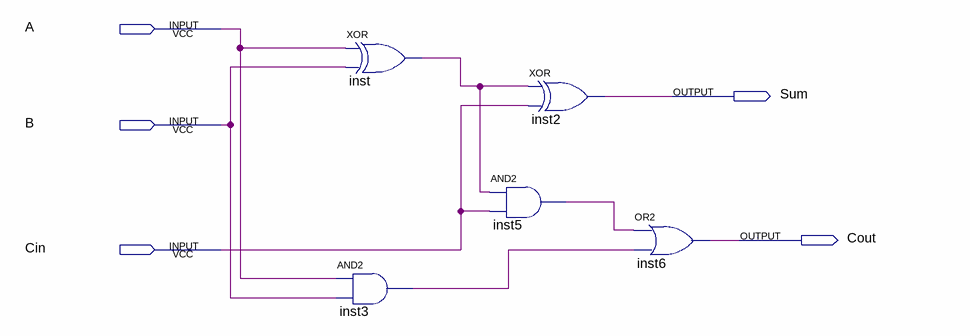
[diagram p0: schematic sheet]
// Quartus schematic Full_Adder_1bit.bdf as structural Verilog: 5 symbols, 5 pins
module Full_Adder_1bit (
  input  A,
  input  B,
  input  Cin,
  output Sum,
  output Cout
);

  wire inst3_out, inst5_out, inst_out;

  xor inst (inst_out, A, B);
  and inst3 (inst3_out, A, B);
  xor inst2 (Sum, inst_out, Cin);
  and inst5 (inst5_out, inst_out, Cin);
  or inst6 (Cout, inst5_out, inst3_out);
endmodule
